# Altium schematic sheet LSM模块.SchDoc
size A4
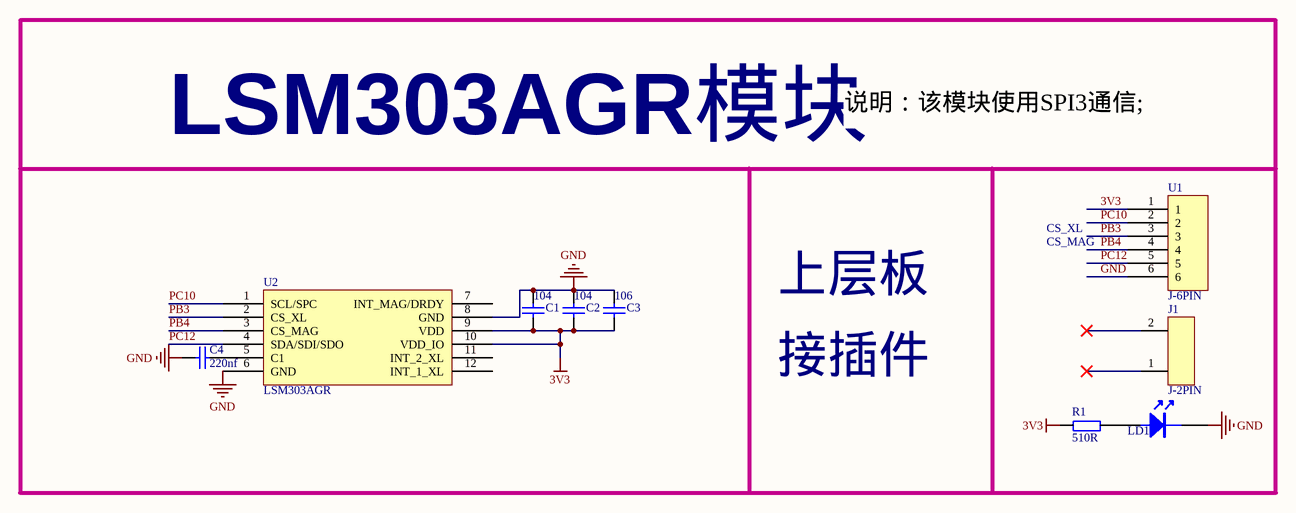
[diagram p0: LSM模块.SchDoc]

## Parts
C1  104  [C-0805c]
C2  104  [C-0805c]
C3  106  [C-0805C]
C4  220nf  [C-0805C]
J1  J-2PIN  [HDR1X2]
LD1  (no value)  [D-0603D]
R1  510R  [R-0603R]
U1  J-6PIN  [LSM底座]
U2  LSM303AGR  [LSM电子罗盘]

## Nets
3V3: C1.2 C2.2 C3.2 R1.1 U1.1 U2.9(VDD) U2.10(VDD_IO)
GND: C1.1 C2.1 C3.1 C4.2 LD1.2 U1.6 U2.6(GND) U2.8(GND)
PB3: U1.3 U2.2(CS_XL)
PB4: U1.4 U2.3(CS_MAG)
PC10: U1.2 U2.1(SCL/SPC)
PC12: U1.5 U2.4(SDA/SDI/SDO)
NetC4_1: C4.1 U2.5(C1)
NetLD1_1: LD1.1 R1.2

Not connected (* = marked no-connect by the designer): J1 1* 2*; U2 7(INT_MAG/DRDY) 11(INT_2_XL) 12(INT_1_XL)

## Notes on the sheet
- LSM303AGR模块
- 说明：该模块使用SPI3通信;
- CS_XL
- CS_MAG
- 上层板
- 接插件

## Library data of the parts
C1-C4 = Cap: Capacitor; Published: 8-Jun-2000; LatestRevisionDate: 17-Jul-2002; LatestRevisionNote: Re-released for DXP Platform.; PackageReference: RAD-0.3; Publisher: Altium Limited
  C1 C2: Value: 104
  C3: Value: 106
  C4: Value: 220nf
J1 = J-2PIN: SOCKET
LD1 = LED
R1 = Resistor: RES, 10K, 5%, 0.1 W, 0603
U2 = LSM303AGR: e-compass